# Altium schematic sheet control_0.1.SchDoc
size A3; CheckedBy: Harakivi; Author: Harakivi; DrawnBy: Harakivi
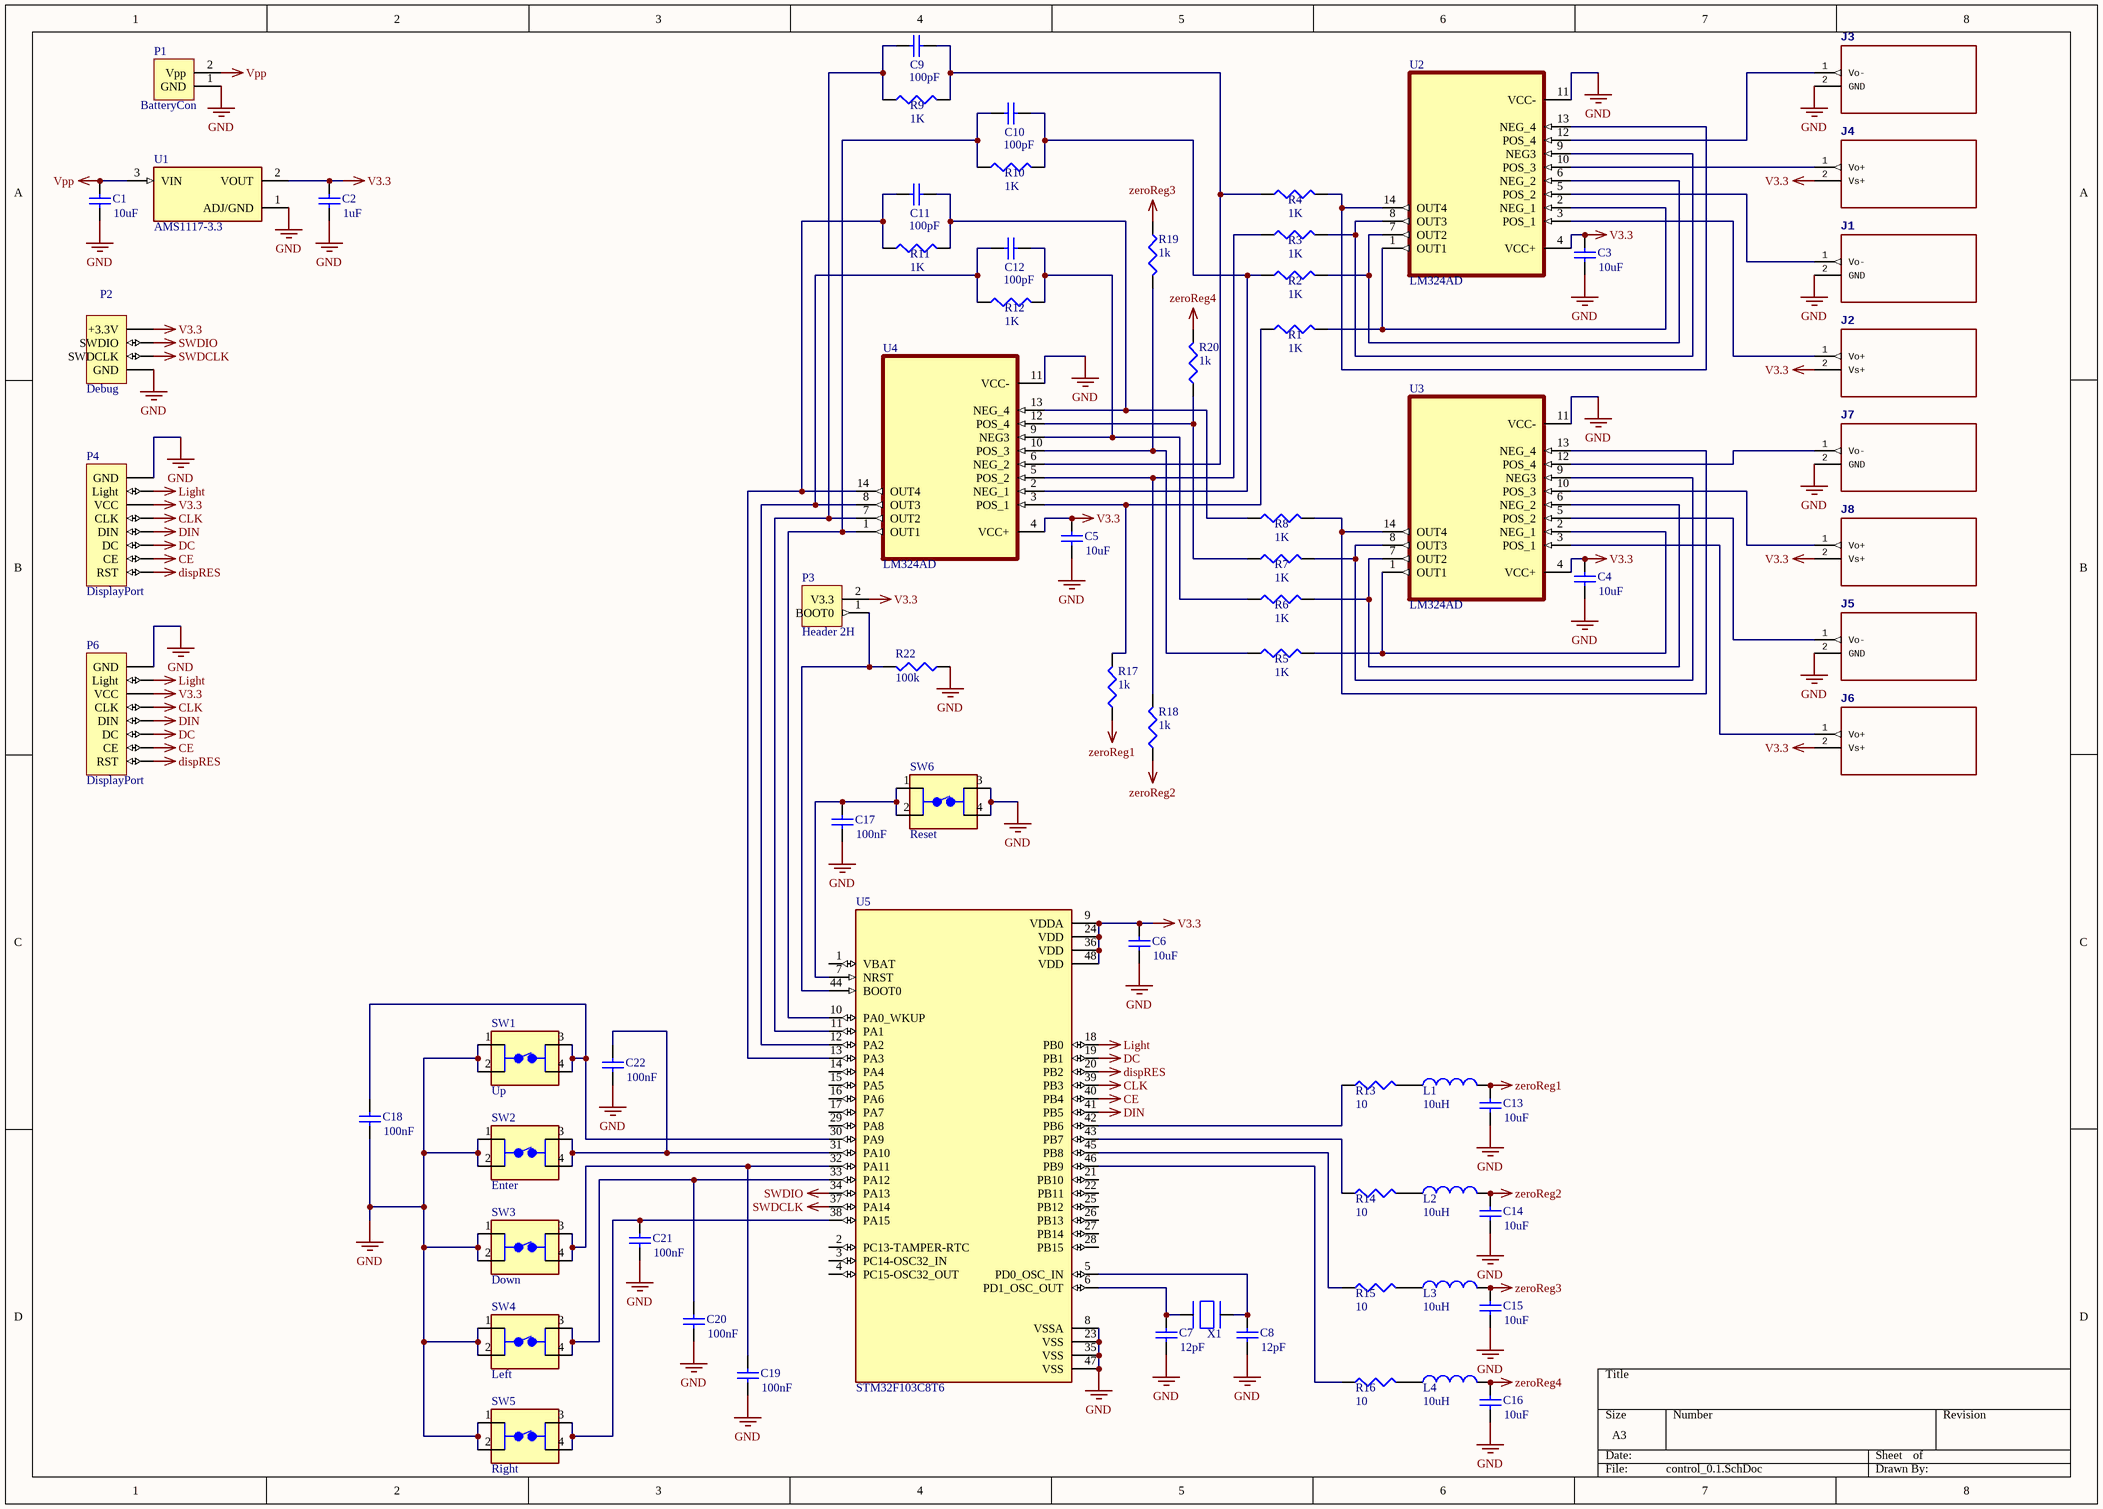
[diagram p0: control_0.1.SchDoc]

## Parts
C1  value 10uF  [C1206]  (hidden comment: Cap Semi)
C2  value 1uF  [C1206]  (hidden comment: Cap Semi)
C3  value 10uF  [C1206]  (hidden comment: Cap Semi)
C4  value 10uF  [C1206]  (hidden comment: Cap Semi)
C5  value 10uF  [C1206]  (hidden comment: Cap Semi)
C6  value 10uF  [C1206]  (hidden comment: Cap Semi)
C7  value 12pF  [C1206]  (hidden comment: Cap Semi)
C8  value 12pF  [C1206]  (hidden comment: Cap Semi)
C9  value 100pF  [C1206]  (hidden comment: Cap Semi)
C10  value 100pF  [C1206]  (hidden comment: Cap Semi)
C11  value 100pF  [C1206]  (hidden comment: Cap Semi)
C12  value 100pF  [C1206]  (hidden comment: Cap Semi)
C13  value 10uF  [C1206]  (hidden comment: Cap Semi)
C14  value 10uF  [C1206]  (hidden comment: Cap Semi)
C15  value 10uF  [C1206]  (hidden comment: Cap Semi)
C16  value 10uF  [C1206]  (hidden comment: Cap Semi)
C17  value 100nF  [C1206]  (hidden comment: Cap Semi)
C18  value 100nF  [C1206]  (hidden comment: Cap Semi)
C19  value 100nF  [C1206]  (hidden comment: Cap Semi)
C20  value 100nF  [C1206]  (hidden comment: Cap Semi)
C21  value 100nF  [C1206]  (hidden comment: Cap Semi)
C22  value 100nF  [C1206]  (hidden comment: Cap Semi)
J1  SAMTEC-A-TSM-102-01-L-SHJ  [SAMTEC-A-TSM-102-01-L-SH]  (value not drawn)
J2  SAMTEC-A-TSM-102-01-L-SHJ  [SAMTEC-A-TSM-102-01-L-SH]  (value not drawn)
J3  SAMTEC-A-TSM-102-01-L-SHJ  [SAMTEC-A-TSM-102-01-L-SH]  (value not drawn)
J4  SAMTEC-A-TSM-102-01-L-SHJ  [SAMTEC-A-TSM-102-01-L-SH]  (value not drawn)
J5  SAMTEC-A-TSM-102-01-L-SHJ  [SAMTEC-A-TSM-102-01-L-SH]  (value not drawn)
J6  SAMTEC-A-TSM-102-01-L-SHJ  [SAMTEC-A-TSM-102-01-L-SH]  (value not drawn)
J7  SAMTEC-A-TSM-102-01-L-SHJ  [SAMTEC-A-TSM-102-01-L-SH]  (value not drawn)
J8  SAMTEC-A-TSM-102-01-L-SHJ  [SAMTEC-A-TSM-102-01-L-SH]  (value not drawn)
L1  value 10uH  [INDC1608L]  (hidden comment: Inductor)
L2  value 10uH  [INDC1608L]  (hidden comment: Inductor)
L3  value 10uH  [INDC1608L]  (hidden comment: Inductor)
L4  value 10uH  [INDC1608L]  (hidden comment: Inductor)
P1  BatteryCon  [HDR1X2H]
P2  Debug  [HDR1X4H]
P3  Header 2H  [HDR1X2H]
P4  DisplayPort  [HDR1X8]
P6  DisplayPort  [HDR1X8]
R1  value 1K  [14-1210]  (hidden comment: Res3)
R2  value 1K  [14-1210]  (hidden comment: Res3)
R3  value 1K  [14-1210]  (hidden comment: Res3)
R4  value 1K  [14-1210]  (hidden comment: Res3)
R5  value 1K  [14-1210]  (hidden comment: Res3)
R6  value 1K  [14-1210]  (hidden comment: Res3)
R7  value 1K  [14-1210]  (hidden comment: Res3)
R8  value 1K  [14-1210]  (hidden comment: Res3)
R9  value 1K  [14-1210]  (hidden comment: Res3)
R10  value 1K  [14-1210]  (hidden comment: Res3)
R11  value 1K  [14-1210]  (hidden comment: Res3)
R12  value 1K  [14-1210]  (hidden comment: Res3)
R13  value 10  [14-1210]  (hidden comment: Res3)
R14  value 10  [14-1210]  (hidden comment: Res3)
R15  value 10  [14-1210]  (hidden comment: Res3)
R16  value 10  [14-1210]  (hidden comment: Res3)
R17  value 1k  [14-1210]  (hidden comment: Res3)
R18  value 1k  [14-1210]  (hidden comment: Res3)
R19  value 1k  [14-1210]  (hidden comment: Res3)
R20  value 1k  [14-1210]  (hidden comment: Res3)
R22  value 100k  [14-1210]  (hidden comment: Res3)
SW1  Up  [TE_FSM4JSMA]
SW2  Enter  [TE_FSM4JSMA]
SW3  Down  [TE_FSM4JSMA]
SW4  Left  [TE_FSM4JSMA]
SW5  Right  [TE_FSM4JSMA]
SW6  Reset  [TE_FSM4JSMA]
U1  AMS1117-3.3  [SOT229P700X180-4N]
U2  LM324AD  [SOIC127P600X175-14N]
U3  LM324AD  [SOIC127P600X175-14N]
U4  LM324AD  [SOIC127P600X175-14N]
U5  STM32F103C8T6  [QFP50P900X900X160-48N]
X1  ABLS-8.000MHZ-B4-T  [HC-49/US]  (value not drawn)

## Nets
CE: P4.2(CE) P6.2(CE) U5.40(PB4)
CLK: P4.5(CLK) P6.5(CLK) U5.39(PB3)
DC: P4.3(DC) P6.3(DC) U5.19(PB1)
DIN: P4.4(DIN) P6.4(DIN) U5.41(PB5)
dispRES: P4.1(RST) P6.1(RST) U5.20(PB2)
GND: C1.1 C2.1 C3.1 C4.1 C5.1 C6.1 C7.1 C8.1 C13.1 C14.1 C15.1 C16.1 C17.1 C18.1 C19.1 C20.1 C21.1 C22.1 J1.2(GND) J3.2(GND) J5.2(GND) J7.2(GND) P1.1(GND) P2.1(GND) P4.8(GND) P6.8(GND) R22.1 SW1.1 SW1.2 SW2.1 SW2.2 SW3.1 SW3.2 SW4.1 SW4.2 SW5.1 SW5.2 SW6.3 SW6.4 U1.1(ADJ/GND) U2.11(VCC-) U3.11(VCC-) U4.11(VCC-) U5.8(VSSA) U5.23(VSS) U5.35(VSS) U5.47(VSS)
Light: P4.7(Light) P6.7(Light) U5.18(PB0)
SWDCLK: P2.2(SWDCLK) U5.37(PA14)
SWDIO: P2.3(SWDIO) U5.34(PA13)
V3.3: C2.2 C3.2 C4.2 C5.2 C6.2 J2.2(Vs+) J4.2(Vs+) J6.2(Vs+) J8.2(Vs+) P2.4(+3.3V) P3.2(V3.3) P4.6(VCC) P6.6(VCC) U1.2(VOUT) U2.4(VCC+) U3.4(VCC+) U4.4(VCC+) U5.9(VDDA) U5.24(VDD) U5.36(VDD) U5.48(VDD)
Vpp: C1.2 P1.2(Vpp) U1.3(VIN)
zeroReg1: C13.2 L1.2 R17.1
zeroReg2: C14.2 L2.2 R18.1
zeroReg3: C15.2 L3.2 R19.1
zeroReg4: C16.2 L4.2 R20.2
NetC7_2: C7.2 U5.6(PD1_OSC_OUT) X1.P$1
NetC8_2: C8.2 U5.5(PD0_OSC_IN) X1.P$2
NetC9_1: C9.1 R9.1 U4.7(OUT2) U5.11(PA1)
NetC9_2: C9.2 R4.1 R9.2 U4.6(NEG_2)
NetC10_1: C10.1 R10.1 U4.1(OUT1) U5.10(PA0_WKUP)
NetC10_2: C10.2 R2.1 R10.2 U4.2(NEG_1)
NetC11_1: C11.1 R11.1 U4.14(OUT4) U5.13(PA3)
NetC11_2: C11.2 R8.1 R11.2 U4.13(NEG_4)
NetC12_1: C12.1 R12.1 U4.8(OUT3) U5.12(PA2)
NetC12_2: C12.2 R6.1 R12.2 U4.9(NEG3)
NetC17_2: C17.2 SW6.1 SW6.2 U5.7(NRST)
NetC18_2: C18.2 SW1.3 SW1.4 U5.30(PA9)
NetC19_2: C19.2 SW3.3 SW3.4 U5.32(PA11)
NetC20_2: C20.2 SW4.3 SW4.4 U5.33(PA12)
NetC21_2: C21.2 SW5.3 SW5.4 U5.38(PA15)
NetC22_2: C22.2 SW2.3 SW2.4 U5.31(PA10)
NetJ1_1: J1.1(Vo-) U2.5(POS_2)
NetJ2_1: J2.1(Vo+) U2.3(POS_1)
NetJ3_1: J3.1(Vo-) U2.12(POS_4)
NetJ4_1: J4.1(Vo+) U2.10(POS_3)
NetJ5_1: J5.1(Vo-) U3.5(POS_2)
NetJ6_1: J6.1(Vo+) U3.3(POS_1)
NetJ7_1: J7.1(Vo-) U3.12(POS_4)
NetJ8_1: J8.1(Vo+) U3.10(POS_3)
NetL1_1: L1.1 R13.2
NetL2_1: L2.1 R14.2
NetL3_1: L3.1 R15.2
NetL4_1: L4.1 R16.2
NetP3_1: P3.1(BOOT0) R22.2 U5.44(BOOT0)
NetR1_1: R1.1 R17.2 U4.3(POS_1)
NetR1_2: R1.2 U2.1(OUT1) U2.2(NEG_1)
NetR2_2: R2.2 U2.6(NEG_2) U2.7(OUT2)
NetR3_1: R3.1 R18.2 U4.5(POS_2)
NetR3_2: R3.2 U2.8(OUT3) U2.9(NEG3)
NetR4_2: R4.2 U2.13(NEG_4) U2.14(OUT4)
NetR5_1: R5.1 R19.2 U4.10(POS_3)
NetR5_2: R5.2 U3.1(OUT1) U3.2(NEG_1)
NetR6_2: R6.2 U3.6(NEG_2) U3.7(OUT2)
NetR7_1: R7.1 R20.1 U4.12(POS_4)
NetR7_2: R7.2 U3.8(OUT3) U3.9(NEG3)
NetR8_2: R8.2 U3.13(NEG_4) U3.14(OUT4)
NetR13_1: R13.1 U5.42(PB6)
NetR14_1: R14.1 U5.43(PB7)
NetR15_1: R15.1 U5.45(PB8)
NetR16_1: R16.1 U5.46(PB9)

Not connected (* = marked no-connect by the designer): U5 1(VBAT) 2(PC13-TAMPER-RTC) 3(PC14-OSC32_IN) 4(PC15-OSC32_OUT) 14(PA4) 15(PA5) 16(PA6) 17(PA7) 21(PB10) 22(PB11) 25(PB12) 26(PB13) 27(PB14) 28(PB15) 29(PA8)

## Library data of the parts
C1-C22 = Cap Semi: Capacitor (Semiconductor SIM Model); Published: 8-Jun-2000; LatestRevisionDate: 29-May-2009; LatestRevisionNote: IPC-7351 Footprint Added.; PackageReference: C1206; Publisher: Altium Limited; PackageDescription: Chip Capacitor
L1-L4 = Inductor: Code_IEC: 1005; Published: 8-Jun-2000; LatestRevisionDate: 29-May-2009; LatestRevisionNote: IPC-7351 Footprint Added.; PackageReference: 0402-A; Publisher: Altium Limited; PackageDescription: Chip Inductor; Code_JEITA: 0402
P1 P3 = Header 2H: Header, 2-Pin, Right Angle; LatestRevisionDate: 17-Jul-2002; LatestRevisionNote: Re-released for DXP Platform.; Publisher: Altium Limited
P2 = Header 4H: Header, 4-Pin, Right Angle; LatestRevisionDate: 17-Jul-2002; LatestRevisionNote: Re-released for DXP Platform.; Publisher: Altium Limited
P4 P6 = Header 8: Header, 8-Pin; LatestRevisionDate: 17-Jul-2002; LatestRevisionNote: Re-released for DXP Platform.; Publisher: Altium Limited
R1-R20 R22 = Res3: Resistor; Published: 8-Jun-2000; LatestRevisionDate: 29-May-2009; LatestRevisionNote: IPC-7351 Footprint Added.; PackageReference: J1-0603; Publisher: Altium Limited; PackageDescription: Chip Resistor
SW1-SW6 = FSM4JSMA: Tactile Switch SPST-NO Top Actuated Surface Mount; Contact_Current_Rating: 50 mA; Configuration_Pole-Throw: Single Pole - Single Throw; MF: TE Connectivity; SnapEDA_Link: https://www.snapeda.com/parts/FSM4JSMA/TE%20Connectivity%20ALCOSWITCH%20Switches/view-part/543632/?ref=snap; Availability: Unavailable; TE_purchase_URL: https://www.te.com/usa-en/product-4-1437565-1.html?te_bu=Cor&te_type=disp&te_campaign=seda_glo_cor-seda-global-disp-prtnr-fy19-seda-model-bom-cta_sma-317_1&elqCampaignId=32493; MP: FSM4JSMA; EU_RoHS_Compliance: Compliant; Price: None; Value: *; Package: None
U1 = AMS1117-3.3: Sot223/Pkg 1-Amp 3.3-Volt Low Drop Out Voltage Regulatator; MF: Advanced Monolithic Systems; Price: None; Package: None; Value: *; MP: AMS1117-3.3; Availability: Unavailable; SnapEDA_Link: https://www.snapeda.com/parts/AMS1117-3.3/Advanced%20Monolithic%20Systems/view-part/53450/?ref=snap
U2-U4 = LM324AD: Op Amp Quad Low Power Amplifier Â±15V/30V 14-Pin SOIC Tube; MF: Texas Instruments; Value: *; Price: None; Package: None; Availability: Unavailable; MP: LM324AD; SnapEDA_Link: https://www.snapeda.com/parts/LM324AD/Texas%20Instruments/view-part/4804679/?ref=snap
U5 = STM32F103C8T6: ARMÂ® CortexÂ®-M3 STM32F1 Microcontroller IC 32-Bit 72MHz 64KB _64K x 8_ FLASH; MF: STMicroelectronics; Price: None; Package: LQFP-48 STMicroelectronics; Value: *; MP: STM32F103C8T6; Availability: Unavailable; SnapEDA_Link: https://www.snapeda.com/parts/STM32F103C8T6/STMicroelectronics/view-part/52195/?ref=snap
X1 = ABLS-8.000MHZ-B4-T: 8MHz Â±30ppm Crystal 18pF 80 Ohms HC-49/US; MF: Abracon LLC; Price: None; Package: HC-49/US Abracon LLC; Availability: Unavailable; SnapEDA_Link: https://www.snapeda.com/parts/ABLS-8.000MHZ-B4-T/Abracon%20LLC/view-part/306310/?ref=snap; Value: *; MP: ABLS-8.000MHZ-B4-T